# Altium schematic sheet CAN.SchDoc: CAN Transceiver
size A; DocumentNumber: 7; SheetNumber: 7; SheetTotal: 11
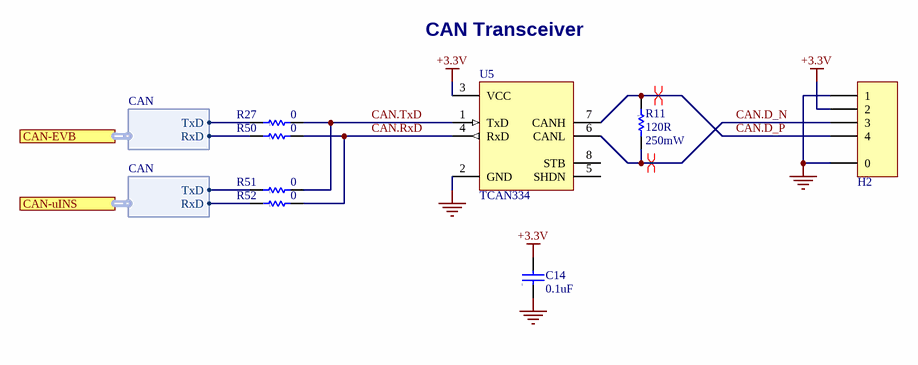
[diagram p0: CAN.SchDoc]

## Parts
C14  value 0.1uF  [0402]  (hidden comment: Cap)
H2  Hdr - 4pin - mount  [SM04B-GHS-TB(LF)(SN)]  (value not drawn)
R11  value 120R  Max Power Dissipation: 250mW  [R0603]  (hidden comment: Res)
R27  value 0  [R0402]  (hidden comment: Res)
R50  value 0  [R0402]  (hidden comment: Res)
R51  value 0  [R0402]  (hidden comment: Res)
R52  value 0  [R0402]  (hidden comment: Res)
U5  TCAN334  [SOT23-8-65P280X145-8N]

## Ports
CAN-EVB (harness CAN), CAN-uINS (harness CAN)

## Harnesses
CAN: TxD, RxD

## Nets
+3.3V: C14.2 H2.2 U5.3(VCC)
GND: C14.1 H2.0 H2.1 U5.2(GND)
CAN.D_N: H2.3 R11.2 U5.6(CANL)
CAN.D_P: H2.4 R11.1 U5.7(CANH)
CAN.RxD: R50.2 R52.2 U5.4(RxD)
CAN.TxD: R27.2 R51.2 U5.1(TxD)
NetR27_1: R27.1 ; port CAN-EVB.TxD
NetR50_1: R50.1 ; port CAN-EVB.RxD
NetR51_1: R51.1 ; port CAN-uINS.TxD
NetR52_1: R52.1 ; port CAN-uINS.RxD

Not connected (* = marked no-connect by the designer): U5 5(SHDN) 8(STB)

## Buses and harness runs
harness  = port CAN-EVB
harness  = port CAN-uINS

## Layout directives
differential pair; differential pair class CAN: CAN.D_N, CAN.D_P

## Notes on the sheet
- CAN Transceiver
- Date
- Sheet
- Project
- Time
- PCB
- Assy
- of
- Size
- A
- File

## Library data of the parts
C14 = Cap: CAP CER .10UF 50V X7R 10% 0402; Manufacturer: TDK Corporation; Manufacturer Part Number: C1005X7R1H104K; Capacitance: 0.1µF; Published: 8-Jun-2000; LatestRevisionDate: 17-Jul-2002; LatestRevisionNote: Re-released for DXP Platform.; Publisher: Altium Limited; Category: Capacitors; Supplier 1: Digi-Key; Supplier Part Number 1: 445-5932-1-ND; RoHS: RoHS Compliant; Stock 1: 174080; Pricing 1: 1=0.3, 10=0.2, 100=0.08, 250=0.05752, 500=0.041, 1000=0.03 (USD); Voltage - Rated: 50V; Tolerance: ±10%; Temperature Coefficient: X7R; Mounting Type: Surface Mount, MLCC; Operating Temperature: -55°C ~ 125°C; Applications: General Purpose; Ratings: -; Package / Case: 0402 (1005 Metric); Size / Dimension: 0.039" L x 0.020" W (1.00mm x 0.50mm); Height: -; Thickness: 0.022" (0.55mm); Lead Spacing: -; Features: -; Packaging: Cut Tape (CT); Lead Style: -; ComponentLink1URL: http://www.tdk.co.jp/tefe02/e412_c.pdf; ComponentLink1Description: http://www.tdk.co.jp/tefe02/e412_c.pdf
H2 = Hdr - 4pin - mount: CONN HEADER GH SIDE 4POS 1.25MM; Manufacturer: JST; Manufacturer Part Number: SM04B-GHS-TB(LF)(SN)-; Number of Positions: 4; Connector Type: Outer Shroud Contact; Pitch: 0.049inch; Supplier 1: Digi-Key; Supplier Part Number 1: 455-1566-1-ND; Stock 1: 1762; Pricing 1: 1=0.45, 10=0.423, 100=0.3244, 500=0.28212, 1000=0.23274 (USD); Mount: Surface Mount; Contact Plating: Tin; Colour: Natural; Number of Rows: 1; Packaging: Cut Tape; Termination: Solder; Fastening Type: Ramp
R11 = Res: RES SMD 120 OHM 5% 1/4W 0603; Manufacturer: Rohm; Manufacturer Part Number: ESR03EZPJ121; Temperature Coefficient: 200ppm/°C; Supplier 1: Digi-Key; Supplier Part Number 1: RHM120DDKR-ND; Stock 1: 89476; Pricing 1: 1=0.1, 10=0.087, 100=0.0333, 1000=0.01464, 2500=0.01264 (USD); Case/Package: 0603; Case Code (Metric): 1608; Case Code (Imperial): 0603; Min Operating Temperature: -55°C; Max Operating Temperature: 155°C; Tolerance: 5%; Package Quantity: 1; Resistance: 120R; Power Rating: 250mW; Packaging: Tape and Reel; Composition: Thick Film; Number of Terminations: 2; Length: 0.063inch; Height: 0.022inch; Width: 0.031inch; Lead Free: Lead Free; ComponentLink1URL: https://datasheet.ciiva.com/2495/esr-2495284.pdf; ComponentLink1Description: https://datasheet.ciiva.com/2495/esr-2495284.pdf; ComponentLink2URL: https://datasheet.ciiva.com/2495/esr-2495285.pdf; ComponentLink2Description: https://datasheet.ciiva.com/2495/esr-2495285.pdf; ComponentLink3URL: https://datasheet.ciiva.com/2495/esr-2495286.pdf; ComponentLink3Description: https://datasheet.ciiva.com/2495/esr-2495286.pdf
R27 R50-R52 = Res: RES SMD 0 OHM JUMPER 1/16W 0402; Manufacturer: Yageo; Manufacturer Part Number: RC0402JR-070RL; Resistor Case Style: 0402 [1005 Metric]; Resistance Tolerance: ± 5%; Resistor Element Type: Thick Film; SVHC: No SVHC (20-Jun-2016); Resistance: 0mR; Power Rating: 62.5mW; Tolerance: 5%; Voltage Rating: 50V; Max Power Dissipation: 63mW; Temperature Coefficient: 200ppm/°C; Product Range: -; Automotive Qualification Standard: -; MSL: MSL 1 - Unlimited; ComponentLink1URL: https://datasheet.ciiva.com/2452/pyu-rc0402-51-rohs-l-6-2452608.pdf; ComponentLink1Description: https://datasheet.ciiva.com/2452/pyu-rc0402-51-rohs-l-6-2452608.pdf; ComponentLink2URL: https://datasheet.ciiva.com/2452/pyu-r-int-thick-7-2452609.pdf; ComponentLink2Description: https://datasheet.ciiva.com/2452/pyu-r-int-thick-7-2452609.pdf; ComponentLink3URL: https://datasheet.ciiva.com/2452/pyu-r-int-thick-7-2452610.pdf; ComponentLink3Description: https://datasheet.ciiva.com/2452/pyu-r-int-thick-7-2452610.pdf; ComponentLink4URL: https://datasheet.ciiva.com/11808/0900766b80c66297-11808195.pdf; ComponentLink4Description: https://datasheet.ciiva.com/11808/0900766b80c66297-11808195.pdf; ComponentLink5URL: https://datasheet.ciiva.com/8896/pyu-rc0402-51-rohs-l-6-8896201.pdf; ComponentLink5Description: https://datasheet.ciiva.com/8896/pyu-rc0402-51-rohs-l-6-8896201.pdf; ComponentLink6URL: https://datasheet.ciiva.com/28386/pyu-rc0402-51-rohs-l-6-28386633.pdf; ComponentLink6Description: https://datasheet.ciiva.com/28386/pyu-rc0402-51-rohs-l-6-28386633.pdf; ComponentLink7URL: https://datasheet.ciiva.com/22747/1018594-22747515.pdf; ComponentLink7Description: https://datasheet.ciiva.com/22747/1018594-22747515.pdf; ComponentLink8URL: https://datasheet.ciiva.com/15189/getdatasheetpartid-326379-15189533.pdf; ComponentLink8Description: https://datasheet.ciiva.com/15189/getdatasheetpartid-326379-15189533.pdf; ComponentLink9URL: https://datasheet.ciiva.com/7983/1018594-7983535.pdf; ComponentLink9Description: https://datasheet.ciiva.com/7983/1018594-7983535.pdf; Supplier 1: Digi-Key; Supplier Part Number 1: 311-0.0JRDKR-ND; Stock 1: 39749506; Pricing 1: 1=0.1, 10=0.017, 25=0.0124, 50=0.0096, 100=0.007, 250=0.00536, 500=0.00428, 1000=0.00315, 5000=0.00226 (USD); Case/Package: 0402; Contact Plating: Matte,Tin; Case Code (Metric): 1005; Case Code (Imperial): 0402; Min Operating Temperature: -55°C; Max Operating Temperature: 155°C; Composition: Thick Film; Packaging: Tape and Reel; Package Quantity: 1; Number of Terminations: 2; Termination: SMD/SMT; Military Standard: Not; Features: Moisture Resistant; Length: 1mm; Height: 0.016inch; Width: 0.02inch; Depth: 0.5mm; Radiation Hardening: No; REACH SVHC: Unknown; Lead Free: Lead Free
U5 = TCAN334: IC TXRX CAN 3.3V SOT23-8; Manufacturer: Texas Instruments; Manufacturer Part Number: TCAN334DCNR; Supplier 1: Digi-Key; Supplier Part Number 1: 296-47830-1-ND; Stock 1: 2931; Pricing 1: 1=2.6, 10=2.336, 100=1.878, 500=1.54294, 1000=1.27844 (USD); Min Operating Temperature: -40°C; Max Operating Temperature: 125°C; Lead Free: Lead Free